# EasyEDA schematic SCH_High Voltage Multipler_2022-07-10.json
TITLE: Sheet_1; REV: 1.0; Date: 2022-07-05; Sheet: 1/1; Drawn By: limchengwei; Company: Your Company
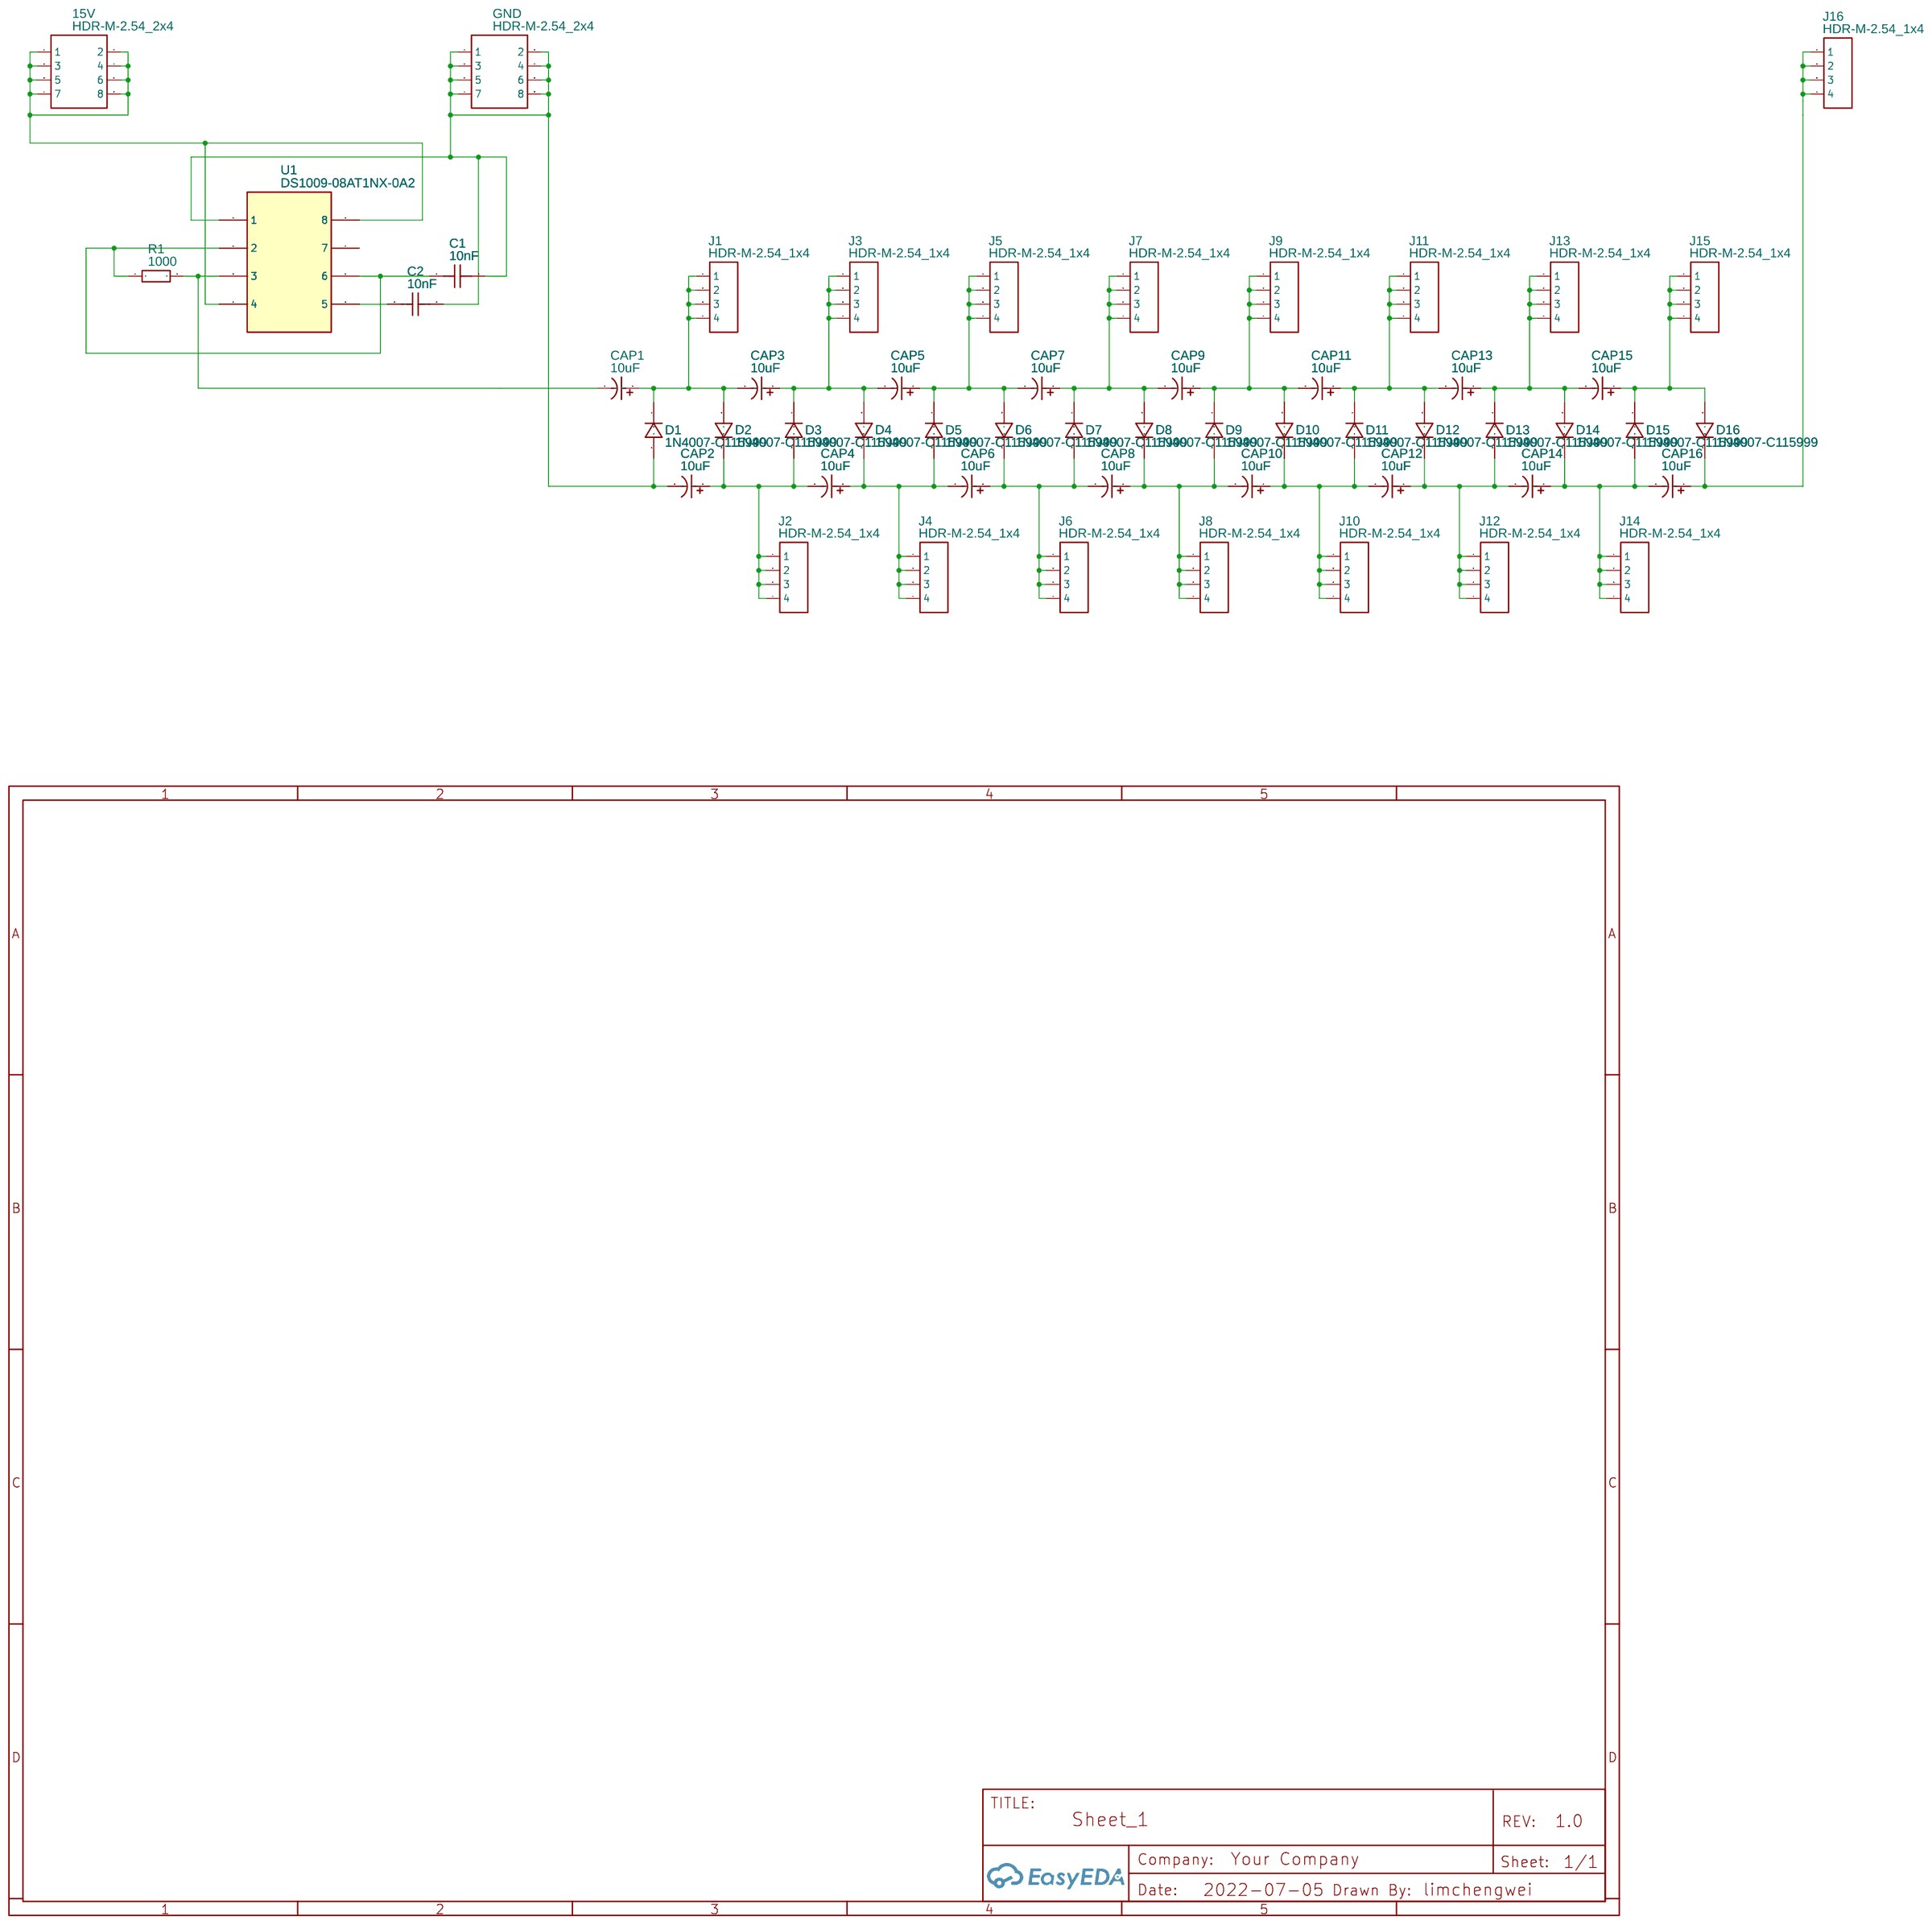
[diagram p0: schematic sheet]

## Parts
15V  HDR-M-2.54_2x4  [HDR-M-2.54_2X4]
C1  10nF  [CAP-TH_L5.0-W2.2-P5.08-D0.6]
C2  10nF  [CAP-TH_L5.0-W2.2-P5.08-D0.6]
CAP1  10uF  [CAP-TH_BD5.0-P2.5-D0.5-FD]
CAP2  10uF  [CAP-TH_BD5.0-P2.5-D0.5-FD]
CAP3  10uF  [CAP-TH_BD5.0-P2.5-D0.5-FD]
CAP4  10uF  [CAP-TH_BD5.0-P2.5-D0.5-FD]
CAP5  10uF  [CAP-TH_BD5.0-P2.5-D0.5-FD]
CAP6  10uF  [CAP-TH_BD5.0-P2.5-D0.5-FD]
CAP7  10uF  [CAP-TH_BD5.0-P2.5-D0.5-FD]
CAP8  10uF  [CAP-TH_BD5.0-P2.5-D0.5-FD]
CAP9  10uF  [CAP-TH_BD5.0-P2.5-D0.5-FD]
CAP10  10uF  [CAP-TH_BD5.0-P2.5-D0.5-FD]
CAP11  10uF  [CAP-TH_BD5.0-P2.5-D0.5-FD]
CAP12  10uF  [CAP-TH_BD5.0-P2.5-D0.5-FD]
CAP13  10uF  [CAP-TH_BD5.0-P2.5-D0.5-FD]
CAP14  10uF  [CAP-TH_BD5.0-P2.5-D0.5-FD]
CAP15  10uF  [CAP-TH_BD5.0-P2.5-D0.5-FD]
CAP16  10uF  [CAP-TH_BD5.0-P2.5-D0.5-FD]
D1  1N4007-C115999  [DO-41_BD2.4-L4.7-P8.70-D0.9-RD]
D2  1N4007-C115999  [DO-41_BD2.4-L4.7-P8.70-D0.9-RD]
D3  1N4007-C115999  [DO-41_BD2.4-L4.7-P8.70-D0.9-RD]
D4  1N4007-C115999  [DO-41_BD2.4-L4.7-P8.70-D0.9-RD]
D5  1N4007-C115999  [DO-41_BD2.4-L4.7-P8.70-D0.9-RD]
D6  1N4007-C115999  [DO-41_BD2.4-L4.7-P8.70-D0.9-RD]
D7  1N4007-C115999  [DO-41_BD2.4-L4.7-P8.70-D0.9-RD]
D8  1N4007-C115999  [DO-41_BD2.4-L4.7-P8.70-D0.9-RD]
D9  1N4007-C115999  [DO-41_BD2.4-L4.7-P8.70-D0.9-RD]
D10  1N4007-C115999  [DO-41_BD2.4-L4.7-P8.70-D0.9-RD]
D11  1N4007-C115999  [DO-41_BD2.4-L4.7-P8.70-D0.9-RD]
D12  1N4007-C115999  [DO-41_BD2.4-L4.7-P8.70-D0.9-RD]
D13  1N4007-C115999  [DO-41_BD2.4-L4.7-P8.70-D0.9-RD]
D14  1N4007-C115999  [DO-41_BD2.4-L4.7-P8.70-D0.9-RD]
D15  1N4007-C115999  [DO-41_BD2.4-L4.7-P8.70-D0.9-RD]
D16  1N4007-C115999  [DO-41_BD2.4-L4.7-P8.70-D0.9-RD]
GND  HDR-M-2.54_2x4  [HDR-M-2.54_2X4]
J1  HDR-M-2.54_1x4  [HDR-M-2.54_1X4]
J2  HDR-M-2.54_1x4  [HDR-M-2.54_1X4]
J3  HDR-M-2.54_1x4  [HDR-M-2.54_1X4]
J4  HDR-M-2.54_1x4  [HDR-M-2.54_1X4]
J5  HDR-M-2.54_1x4  [HDR-M-2.54_1X4]
J6  HDR-M-2.54_1x4  [HDR-M-2.54_1X4]
J7  HDR-M-2.54_1x4  [HDR-M-2.54_1X4]
J8  HDR-M-2.54_1x4  [HDR-M-2.54_1X4]
J9  HDR-M-2.54_1x4  [HDR-M-2.54_1X4]
J10  HDR-M-2.54_1x4  [HDR-M-2.54_1X4]
J11  HDR-M-2.54_1x4  [HDR-M-2.54_1X4]
J12  HDR-M-2.54_1x4  [HDR-M-2.54_1X4]
J13  HDR-M-2.54_1x4  [HDR-M-2.54_1X4]
J14  HDR-M-2.54_1x4  [HDR-M-2.54_1X4]
J15  HDR-M-2.54_1x4  [HDR-M-2.54_1X4]
J16  HDR-M-2.54_1x4  [HDR-M-2.54_1X4]
R1  1000  [RES-TH_BD2.2-L6.5-P10.50-D0.6]
U1  DS1009-08AT1NX-0A2  [DIP-8_L10.0-W6.5-P2.54-LS7.6-BL]

## Library data of the parts
15V GND = HDR-M-2.54_2x4: Supplier Part: C58363; Supplier: LCSC; Contributor: LCEDA_Lib
C1 C2 = CC1H103MC76DB45A30S8: Supplier: LCSC; Supplier Part: C377837; Manufacturer: Dersonic(德尔创); Contributor: LCSC; JLCPCB Part Class: Extended Part
CAP1-CAP16 = RL1E100MC110A00CV0: Supplier: LCSC; Supplier Part: C216293; Manufacturer: Changzhou Huawei Elec; Contributor: LCSC; JLCPCB Part Class: Extended Part
D1-D16 = 1N4007-C115999: Supplier Part: C115999; Supplier: LCSC; Manufacturer: PANJIT; Manufacturer Part: 1N4007; Contributor: LCSC; JLCPCB Part Class: Extended Part
J1-J16 = HDR-M-2.54_1x4: Supplier Part: C124378; Supplier: LCSC; Contributor: LCEDA_Lib
R1 = MF1/4W-300Ω±1% T52: Supplier: LCSC; Supplier Part: C119312; Manufacturer: Chian Chia Elec; Contributor: LCSC; JLCPCB Part Class: Extended Part; Resistance: 300Ω
U1 = DS1009-08AT1NX-0A2: Supplier: LCSC; Manufacturer: CONNFLY; Supplier Part: C72124; JLCPCB Part Class: Extended Part

## Nets
Net-(15V-1): 15V.1 15V.2 15V.3 15V.4 15V.5 15V.6 15V.7 15V.8 U1.4 U1.8
Net-(C1-1): C1.1 R1.1 U1.2 U1.6
Net-(C1-2): C1.2 C2.2 CAP2.2 D1.2(A) GND.1 GND.2 GND.3 GND.4 GND.5 GND.6 GND.7 GND.8 U1.1
Net-(C2-1): C2.1 U1.5
Net-(CAP1-1): CAP1.1 CAP3.2 D1.1(C) D2.2(A) J1.1 J1.2 J1.3 J1.4
Net-(CAP1-2): CAP1.2 R1.2 U1.3
Net-(CAP2-1): CAP2.1 CAP4.2 D2.1(C) D3.2(A) J2.1 J2.2 J2.3 J2.4
Net-(CAP3-1): CAP3.1 CAP5.2 D3.1(C) D4.2(A) J3.1 J3.2 J3.3 J3.4
Net-(CAP4-1): CAP4.1 CAP6.2 D4.1(C) D5.2(A) J4.1 J4.2 J4.3 J4.4
Net-(CAP5-1): CAP5.1 CAP7.2 D5.1(C) D6.2(A) J5.1 J5.2 J5.3 J5.4
Net-(CAP6-1): CAP6.1 CAP8.2 D6.1(C) D7.2(A) J6.1 J6.2 J6.3 J6.4
Net-(CAP7-1): CAP7.1 CAP9.2 D7.1(C) D8.2(A) J7.1 J7.2 J7.3 J7.4
Net-(CAP8-1): CAP8.1 CAP10.2 D8.1(C) D9.2(A) J8.1 J8.2 J8.3 J8.4
Net-(CAP9-1): CAP9.1 CAP11.2 D9.1(C) D10.2(A) J9.1 J9.2 J9.3 J9.4
Net-(CAP10-1): CAP10.1 CAP12.2 D10.1(C) D11.2(A) J10.1 J10.2 J10.3 J10.4
Net-(CAP11-1): CAP11.1 CAP13.2 D11.1(C) D12.2(A) J11.1 J11.2 J11.3 J11.4
Net-(CAP12-1): CAP12.1 CAP14.2 D12.1(C) D13.2(A) J12.1 J12.2 J12.3 J12.4
Net-(CAP13-1): CAP13.1 CAP15.2 D13.1(C) D14.2(A) J13.1 J13.2 J13.3 J13.4
Net-(CAP14-1): CAP14.1 CAP16.2 D14.1(C) D15.2(A) J14.1 J14.2 J14.3 J14.4
Net-(CAP15-1): CAP15.1 D15.1(C) D16.2(A) J15.1 J15.2 J15.3 J15.4
Net-(CAP16-1): CAP16.1 D16.1(C) J16.1 J16.2 J16.3 J16.4

Not connected (* = marked no-connect by the designer): U1 7
